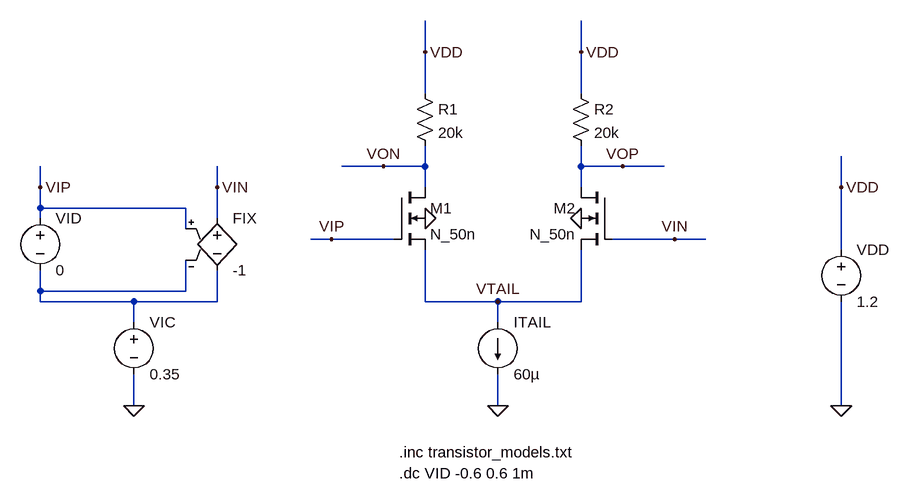
[diagram p0: schematic lab08_diff_pair.asc]
lab08_diff_pair.asc, the LTspice schematic file:
Version 4
SHEET 1 892 900
WIRE 176 -96 176 -144
WIRE 416 -96 416 -144
WIRE 176 -32 176 -96
WIRE 416 -32 416 -96
WIRE 112 80 48 80
WIRE 176 80 176 48
WIRE 176 80 112 80
WIRE 416 80 416 48
WIRE 480 80 416 80
WIRE 544 80 480 80
WIRE -416 112 -416 80
WIRE -144 112 -144 80
WIRE 176 112 176 80
WIRE 416 112 416 80
WIRE 816 112 816 64
WIRE -416 144 -416 112
WIRE -192 144 -416 144
WIRE -416 160 -416 144
WIRE -144 160 -144 112
WIRE -192 176 -192 144
WIRE 32 192 0 192
WIRE 128 192 32 192
WIRE 560 192 464 192
WIRE 608 192 560 192
WIRE 816 208 816 112
WIRE -416 272 -416 240
WIRE -192 272 -192 224
WIRE -192 272 -416 272
WIRE -416 288 -416 272
WIRE -272 288 -416 288
WIRE -144 288 -144 240
WIRE -144 288 -272 288
WIRE 176 288 176 208
WIRE 288 288 176 288
WIRE 416 288 416 208
WIRE 416 288 288 288
WIRE -272 320 -272 288
WIRE 288 320 288 288
WIRE -272 448 -272 400
WIRE 288 448 288 400
WIRE 816 448 816 288
FLAG 176 160 0
FLAG 416 160 0
FLAG 288 448 0
FLAG 816 448 0
FLAG 816 112 VDD
FLAG 176 -96 VDD
FLAG 416 -96 VDD
FLAG -272 448 0
FLAG -416 112 VIP
FLAG 32 192 VIP
FLAG 560 192 VIN
FLAG 112 80 VON
FLAG 480 80 VOP
FLAG -144 112 VIN
FLAG 288 288 VTAIL
SYMBOL nmos4 128 112 R0
SYMATTR InstName M1
SYMATTR Value N_50n
SYMATTR Value2 l=1u w=10u
SYMBOL nmos4 464 112 M0
SYMATTR InstName M2
SYMATTR Value N_50n
SYMATTR Value2 l=1u w=10u
SYMBOL current 288 320 R0
WINDOW 123 0 0 Left 0
WINDOW 39 0 0 Left 0
SYMATTR InstName ITAIL
SYMATTR Value 60µ
SYMBOL res 160 -48 R0
SYMATTR InstName R1
SYMATTR Value 20k
SYMBOL res 400 -48 R0
SYMATTR InstName R2
SYMATTR Value 20k
SYMBOL voltage 816 192 R0
WINDOW 123 0 0 Left 0
WINDOW 39 0 0 Left 0
SYMATTR InstName VDD
SYMATTR Value 1.2
SYMBOL voltage -416 144 R0
WINDOW 123 0 0 Left 0
WINDOW 39 0 0 Left 0
SYMATTR InstName VID
SYMATTR Value 0
SYMBOL voltage -272 304 R0
WINDOW 123 0 0 Left 0
WINDOW 39 0 0 Left 0
SYMATTR InstName VIC
SYMATTR Value 0.35
SYMBOL e -144 144 R0
SYMATTR InstName FIX
SYMATTR Value -1
TEXT 136 520 Left 2 !.inc transistor_models.txt
TEXT 136 552 Left 2 !.dc VID -0.6 0.6 1m

The netlist it stands for:
* lab08_diff_pair.asc
M1 VON VIP VTAIL 0 N_50n l=1u w=10u
M2 VOP VIN VTAIL 0 N_50n l=1u w=10u
ITAIL VTAIL 0 60µ
R1 VDD VON 20k
R2 VDD VOP 20k
VDD VDD 0 1.2
VID VIP N001 0
VIC N001 0 0.35
E§FIX VIN N001 VIP N001 -1
.model NMOS NMOS
.model PMOS PMOS
.lib standard.mos
.inc transistor_models.txt
.dc VID -0.6 0.6 1m
.backanno
.end